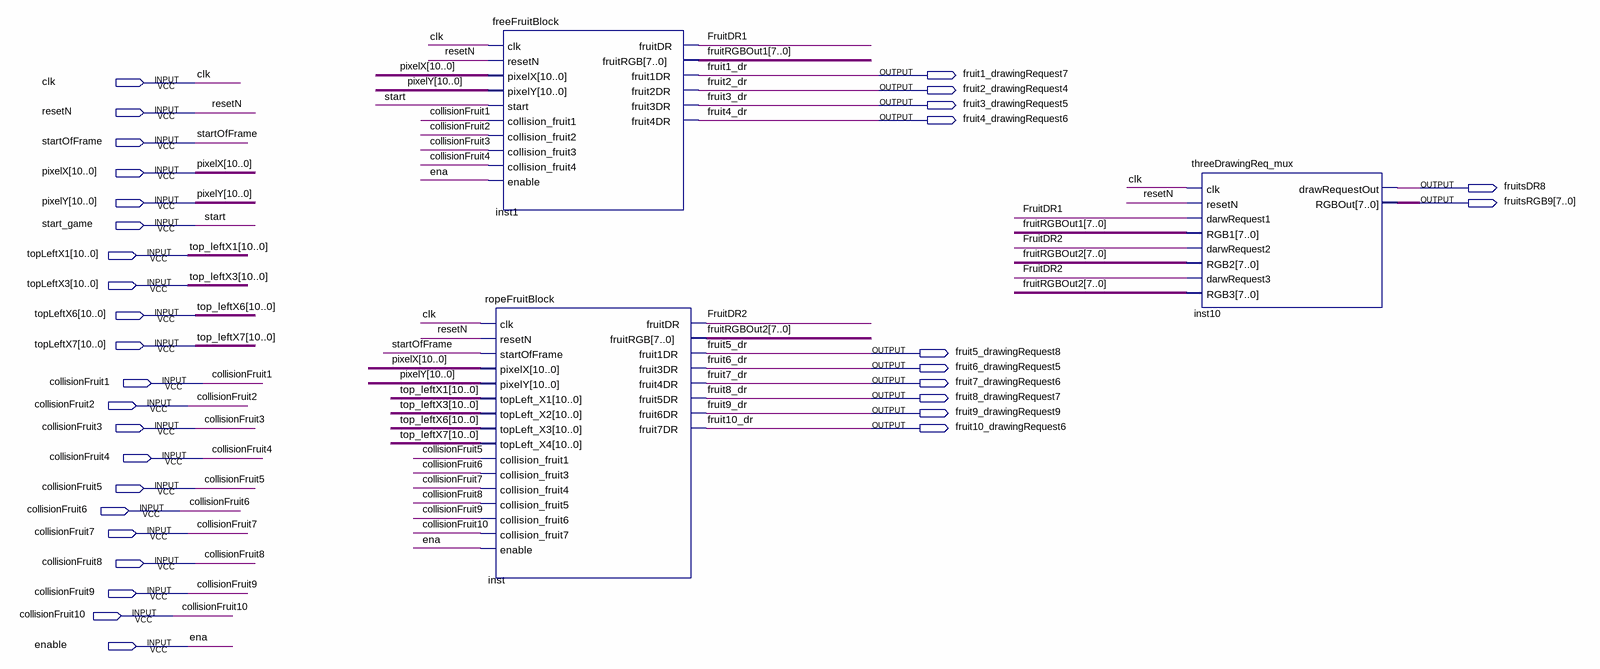
[diagram p0: schematic sheet]
// Quartus schematic fruitBlock.bdf as structural Verilog: 3 symbols, 33 pins
module fruitBlock (
  input  clk,
  input  resetN,
  input  startOfFrame,
  input  [10:0] pixelX,
  input  [10:0] pixelY,
  input  start_game,
  input  [10:0] topLeftX1,
  input  [10:0] topLeftX3,
  input  [10:0] topLeftX6,
  input  [10:0] topLeftX7,
  input  collisionFruit1,
  input  collisionFruit2,
  input  collisionFruit3,
  input  collisionFruit4,
  input  collisionFruit5,
  input  collisionFruit6,
  input  collisionFruit7,
  input  collisionFruit8,
  input  collisionFruit9,
  input  collisionFruit10,
  input  enable,
  output fruit1_drawingRequest7,
  output fruit2_drawingRequest4,
  output fruit3_drawingRequest5,
  output fruit4_drawingRequest6,
  output fruitsDR8,
  output [7:0] fruitsRGB9,
  output fruit5_drawingRequest8,
  output fruit6_drawingRequest5,
  output fruit7_drawingRequest6,
  output fruit8_drawingRequest7,
  output fruit9_drawingRequest9,
  output fruit10_drawingRequest6
);

  wire FruitDR1, FruitDR2;
  wire [7:0] fruitRGBOut1, fruitRGBOut2;

  freeFruitBlock inst1 (
    .clk(clk), .resetN(resetN), .pixelX(pixelX), .pixelY(pixelY), .start(start_game),
    .collision_fruit1(collisionFruit1), .collision_fruit2(collisionFruit2),
    .collision_fruit3(collisionFruit3), .collision_fruit4(collisionFruit4), .enable(enable),
    .fruitDR(FruitDR1), .fruitRGB(fruitRGBOut1), .fruit1DR(fruit1_drawingRequest7),
    .fruit2DR(fruit2_drawingRequest4), .fruit3DR(fruit3_drawingRequest5), .fruit4DR(fruit4_drawingRequest6));
  ropeFruitBlock inst (
    .clk(clk), .resetN(resetN), .startOfFrame(startOfFrame), .pixelX(pixelX), .pixelY(pixelY),
    .topLeft_X1(topLeftX1), .topLeft_X2(topLeftX3), .topLeft_X3(topLeftX6), .topLeft_X4(topLeftX7),
    .collision_fruit1(collisionFruit5), .collision_fruit3(collisionFruit6),
    .collision_fruit4(collisionFruit7), .collision_fruit5(collisionFruit8),
    .collision_fruit6(collisionFruit9), .collision_fruit7(collisionFruit10), .enable(enable),
    .fruitDR(FruitDR2), .fruitRGB(fruitRGBOut2), .fruit1DR(fruit5_drawingRequest8),
    .fruit3DR(fruit6_drawingRequest5), .fruit4DR(fruit7_drawingRequest6), .fruit5DR(fruit8_drawingRequest7),
    .fruit6DR(fruit9_drawingRequest9), .fruit7DR(fruit10_drawingRequest6));
  threeDrawingReq_mux inst10 (
    .clk(clk), .resetN(resetN), .darwRequest1(FruitDR1), .RGB1(fruitRGBOut1), .darwRequest2(FruitDR2),
    .RGB2(fruitRGBOut2), .darwRequest3(FruitDR2), .RGB3(fruitRGBOut2), .drawRequestOut(fruitsDR8),
    .RGBOut(fruitsRGB9));

  // Other names for the same wires on the sheet: ena = enable; fruit1_dr = fruit1_drawingRequest7;
  //   fruit2_dr = fruit2_drawingRequest4; fruit3_dr = fruit3_drawingRequest5; fruit4_dr = fruit4_drawingRequest6;
  //   fruit5_dr = fruit5_drawingRequest8; fruit6_dr = fruit6_drawingRequest5; fruit7_dr = fruit7_drawingRequest6;
  //   fruit8_dr = fruit8_drawingRequest7; fruit9_dr = fruit9_drawingRequest9; fruit10_dr = fruit10_drawingRequest6;
  //   start = start_game; top_leftX1[10:0] = topLeftX1; top_leftX3[10:0] = topLeftX3; top_leftX6[10:0] = topLeftX6;
  //   top_leftX7[10:0] = topLeftX7
endmodule
